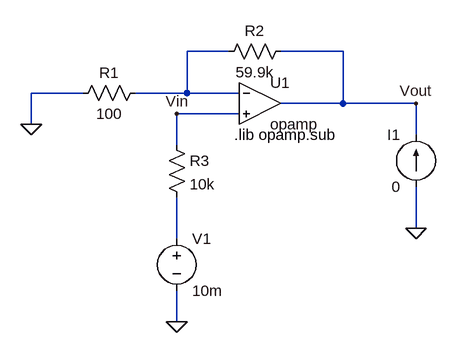
[diagram p0: schematic Opamp.asc]
Opamp.asc, the LTspice schematic file:
Version 4
SHEET 1 880 680
WIRE 272 16 208 16
WIRE 448 16 352 16
WIRE 48 80 -32 80
WIRE 208 80 208 16
WIRE 208 80 128 80
WIRE 288 80 208 80
WIRE 448 96 448 16
WIRE 448 96 352 96
WIRE 560 96 448 96
WIRE 288 112 192 112
WIRE -32 128 -32 80
WIRE 560 144 560 96
WIRE 192 160 192 112
WIRE 560 288 560 224
WIRE 192 304 192 240
WIRE 192 432 192 384
FLAG 560 288 0
FLAG -32 128 0
FLAG 192 432 0
FLAG 192 112 Vin
FLAG 560 96 Vout
SYMBOL res 144 64 R90
WINDOW 0 0 56 VBottom 2
WINDOW 3 32 56 VTop 2
SYMATTR InstName R1
SYMATTR Value 100
SYMBOL res 368 0 R90
WINDOW 0 0 56 VBottom 2
WINDOW 3 32 56 VTop 2
SYMATTR InstName R2
SYMATTR Value 59.9k
SYMATTR SpiceLine tol=10
SYMBOL OpAmps\\opamp 320 32 R0
SYMATTR InstName U1
SYMBOL current 560 224 R180
WINDOW 0 24 80 Left 2
WINDOW 3 24 0 Left 2
WINDOW 123 0 0 Left 0
WINDOW 39 0 0 Left 0
SYMATTR InstName I1
SYMATTR Value 0
SYMBOL res 176 144 R0
SYMATTR InstName R3
SYMATTR Value 10k
SYMBOL voltage 192 288 R0
WINDOW 123 0 0 Left 0
WINDOW 39 0 0 Left 0
SYMATTR InstName V1
SYMATTR Value 10m
TEXT 280 144 Left 2 !.lib opamp.sub

The netlist it stands for:
* Opamp.asc
R1 N001 0 100
R2 Vout N001 59.9k tol=10
XU1 N001 Vin Vout opamp Aol=100K GBW=10Meg  ; pins invin noninvin out
I1 0 Vout 0
R3 Vin N002 10k
V1 N002 0 10m
.lib opamp.sub
.backanno
.end